# EAGLE board MaTouch ESP32-P4 TFT with 4G LTE  Touch 10.1“ MIPI V1.0 (EAGLE 6.1), part 1 of 3
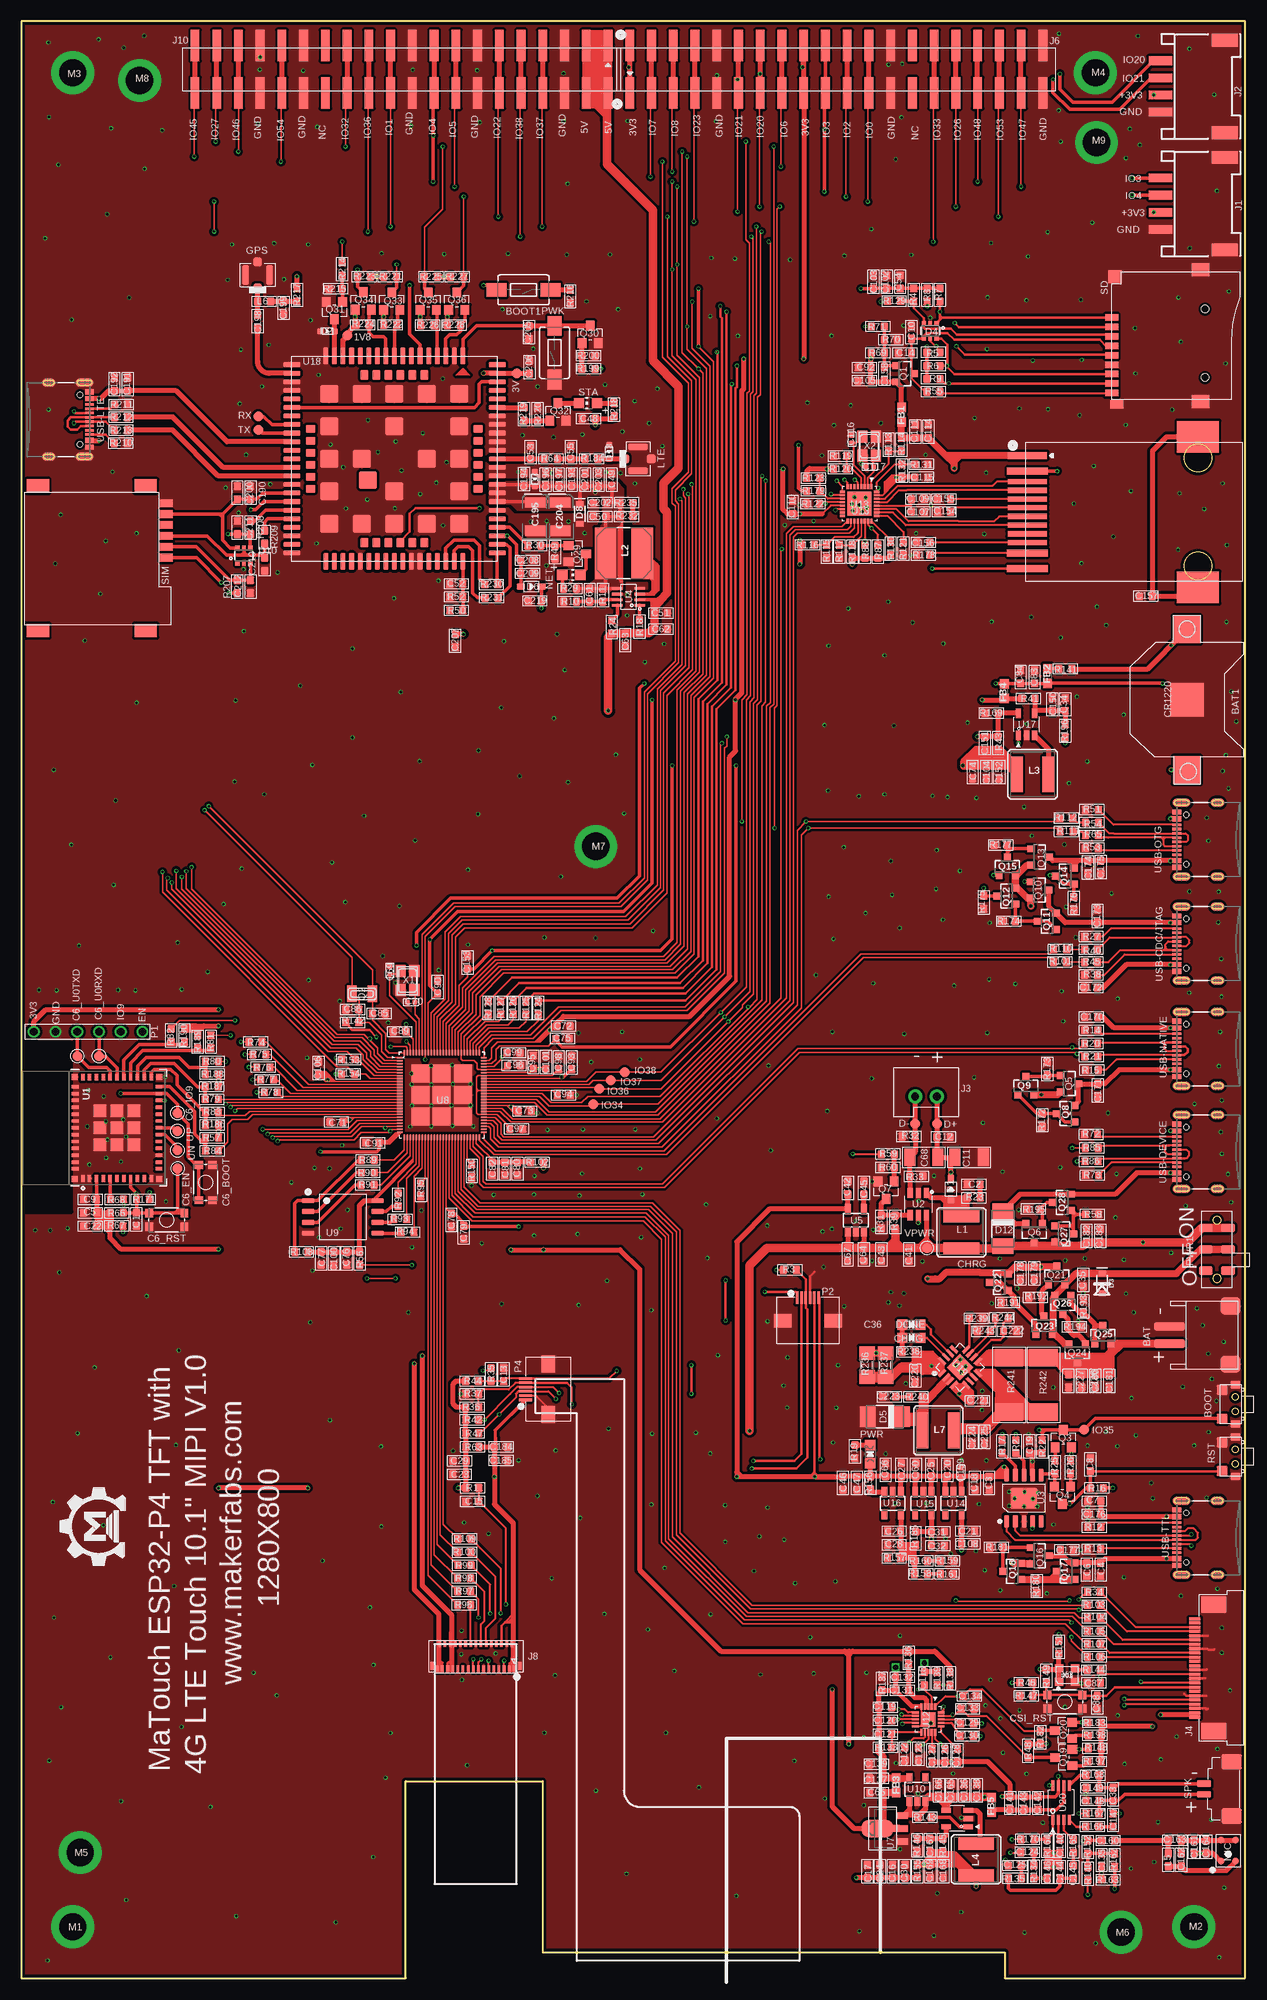
[diagram p7: board, top side]
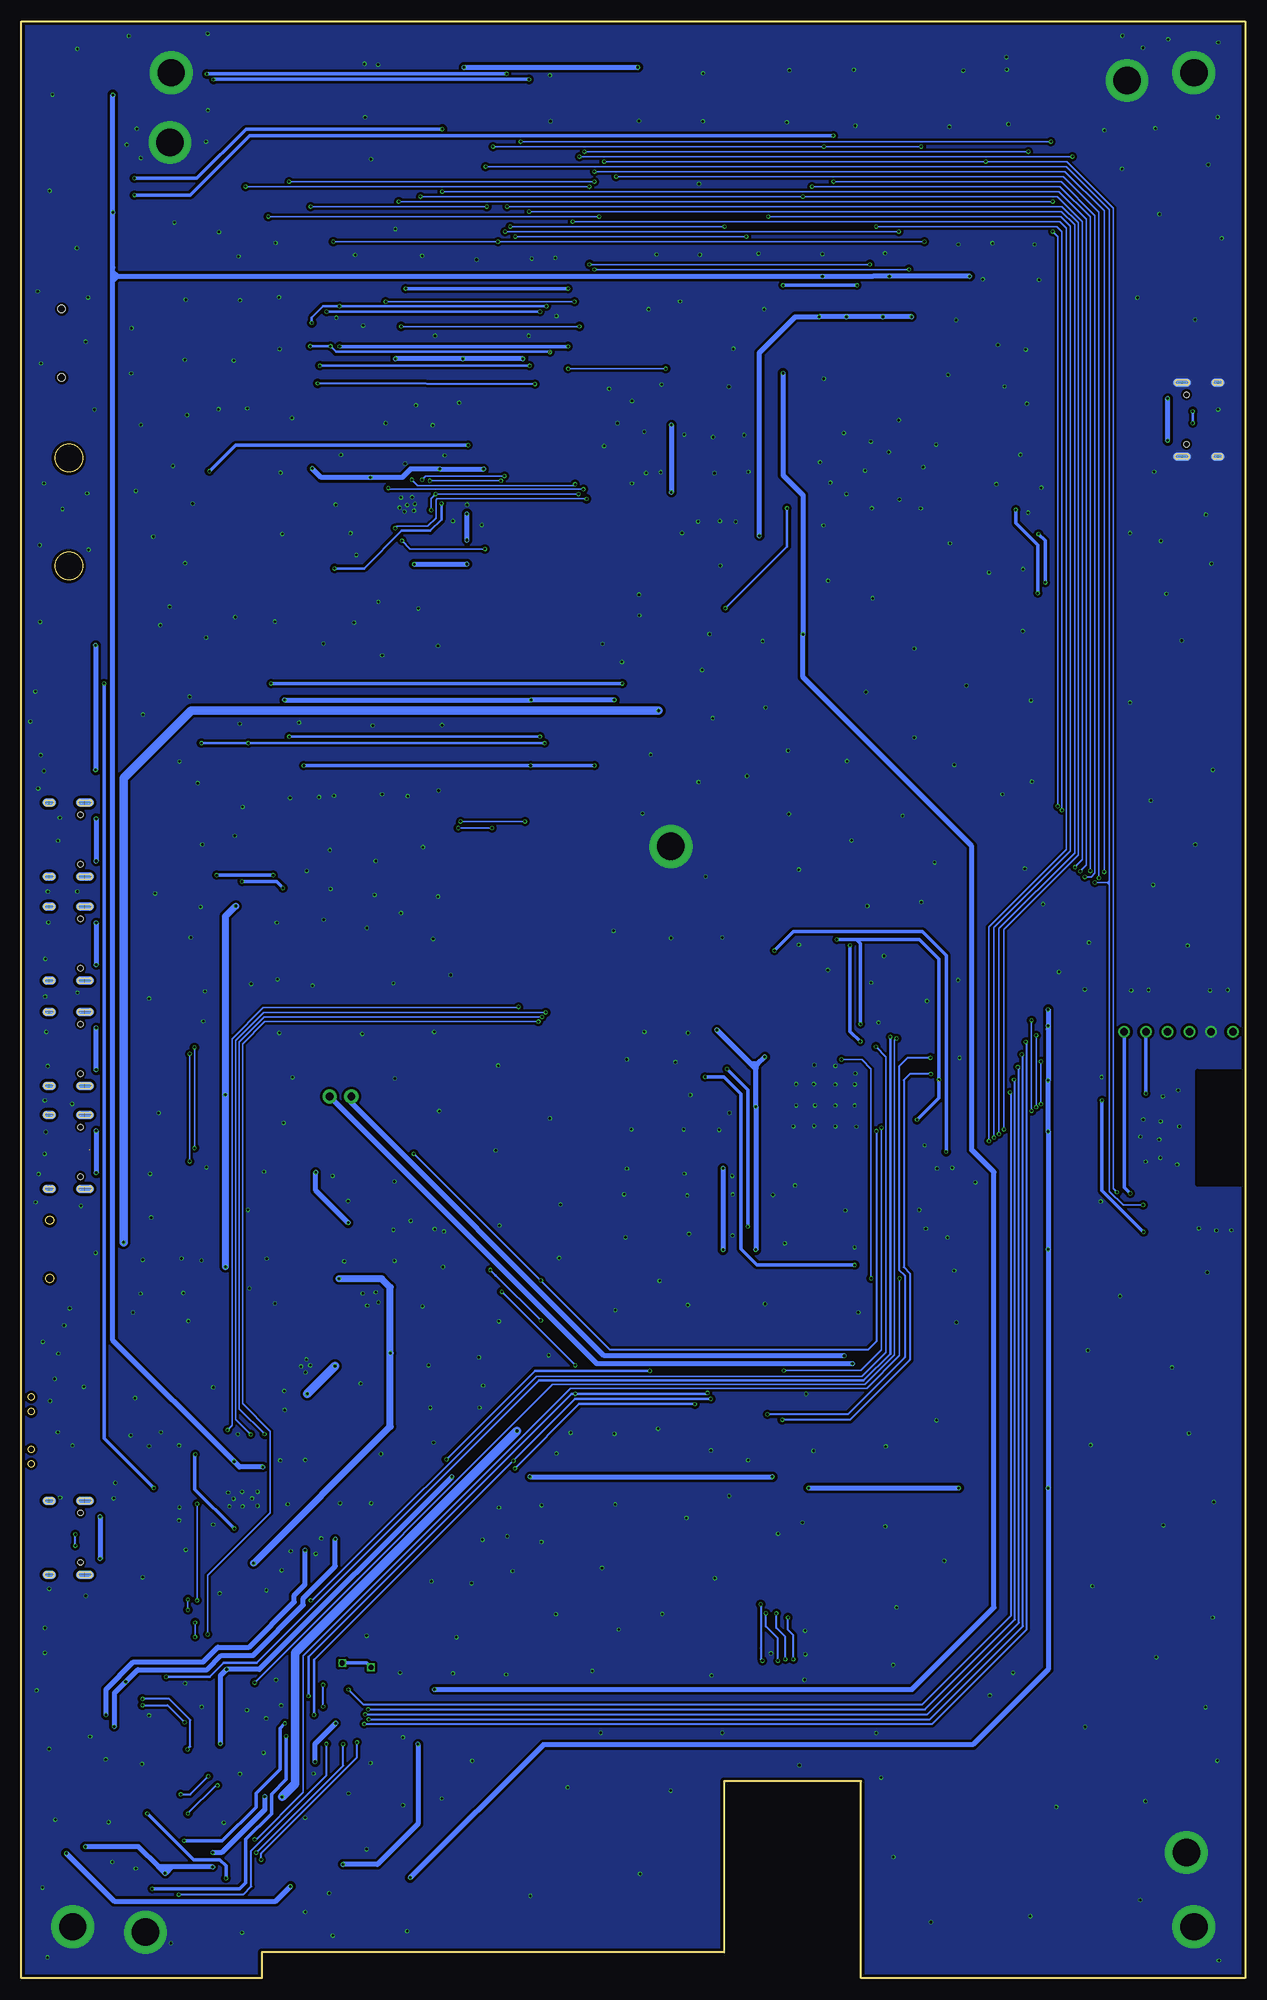
[diagram p8: board, bottom side, seen from below]

Size 143 x 228.6 mm. Coordinates in mm from the lower left corner, seen from the top.
Outline: 60.9,23 44.9,23 44.9,0 0,0 0,228.6 143,228.6 143,0 114.9,0 114.9,3 60.9,3 60.9,22.96
Copper layers (1*16): Top 0.035mm / dielectric 1.5mm / Bottom 0.035mm
Design rules: minimum track width 7mil, minimum drill 10mil, track to track 6mil, track to pad 6mil, pad to pad 6mil, via to via 6mil, smd to smd 0mil, copper to edge 6mil, drill to drill 6mil, minimum pad ring 3mil, minimum via ring 3mil, stop-mask expansion 2mil, vias tented up to drill 100mil, thermal gap 0mil
Net classes: 0 default: width 0.152 mm, drill 0.305 mm, clearance 0.152 mm; 1 vbat: drill 0.305 mm
tRestrict: area 0.1,89.6 to 5.8,109.2; area 70.6,163.4 to 71.1,169.7
bRestrict: area -6,89.6 to -0.3,109.2

## Footprints (pad centres in the part's own frame; a part is rotated, then mirrored left to right if it is on the bottom)
TP-D45MIL = smd 1.143 x 1.143: T 0,0
HW2-SMD-2.0-90D = smd 2 x 2.4: 3 3.4,-2.181; 4 -3.4,-2.181 | smd 1 x 3.6: + -1,4.953; - 1,4.953
CR1220-SMD = smd 3.2 x 3.2: +$1 -8.2,0; +$2 8.2,0 | smd 3.9 x 3.9: - 0,0
2*4*3.5MM = smd 1.15 x 1.3: 1 -1.675,0; 2 1.675,0 | smd 0.9 x 1.2: 3 2.3,1.55; 4 -2.3,1.55
TACTILE_SWITCH_SMD_6.0X3.5MM = smd 2.3 x 1.6: 1 -3.15,0; 2 3.15,0
0603 = smd 0.889 x 0.889: 1 -0.762,0; 2 0.762,0
DISCRETE_C0603 = smd 0.889 x 0.889: 1 -0.762,0; 2 0.762,0
TACTILE_SWITCH_SMD_4.6X2.8MM = smd 0.9 x 1: 1 -2.05,-0.8; 2 2.05,-0.8; 3 2.05,0.8; 4 -2.05,0.8
TP_4545 = smd 1.143 x 1.143: T 0,0
DISCRETE_C1206 = smd 1.27 x 2.032: 1 -1.651,0; 2 1.651,0
DISCRETE_C0402 = smd 0.635 x 0.635: 1 -0.445,0; 2 0.445,0
C0402 = smd 0.635 x 0.635: 1 0,0.484; 2 0,-0.484
C0603 = smd 0.889 x 0.889: 1 0,0.762; 2 0,-0.762
EIA3528 = smd 1.2 x 2.5: A 1.65,0; C -1.65,0
CHIPLED_0805_NOOUTLINE = smd 1.2 x 1.2: A 0,-1.05; C 0,1.05
SOD323 = smd 1 x 0.8: + -1.2,0; - 1.2,0
DISCRETE_SOD523 = smd 0.762 x 0.7: + -0.8,0; - 0.8,0
SOD-323 = smd 0.63 x 0.83: A 1.15,0; C -1.15,0
SOT363 = smd 0.5 x 0.5: 1 -0.75,-0.9; 3 0.75,-0.9; 4 0.75,0.9; 6 -0.75,0.9 | smd 0.4 x 0.5: 2 0,-0.9; 5 0,0.9
DO-214AC = smd 1.8 x 2.4: A 2.025,0; C -2.025,0
0603' = smd 1.1 x 1: 1 -0.85,0; 2 0.85,0
4P-U-FL = smd 1.016 x 1.016: D -1.524,0; GND3 1.524,0 | smd 2.286 x 0.762: GND1 0,1.397; GND2 0,-1.397
HW4-SMD-2.0-90D = smd 1.01 x 2.74: 1 -3,-0.1; 2 -1,-0.1; 3 1,-0.1; 4 3,-0.1 | smd 1.5 x 3: SS1 -5.4,7.4; SS2 5.4,7.4
XH2.54-2P = drill 0.9 pad 1.651: 1 -1.27,0; 2 1.27,0
SMD26-50P-1760L450W = smd 0.3 x 1.3: 1 5.75,0; 2 5.25,0; 3 4.75,0; 4 4.25,0; 5 3.75,0; 6 3.25,0; 7 2.75,0; 8 2.25,0; 9 1.75,0; 10 1.25,0; 11 0.75,0; 12 0.25,0; 13 -0.25,0; 14 -0.75,0; 15 -1.25,0; 16 -1.75,0; 17 -2.25,0; 18 -2.75,0; 19 -3.25,0; 20 -3.75,0; 21 -4.25,0; 22 -4.75,0; 23 -5.25,0; 24 -5.75,0 | smd 2 x 3: 25 -7.4,-2.25; 26 7.4,-2.25
SMD2X20-254P-5080L750W920H = smd 1.02 x 3.65: 1 -24.13,-2.775; 2 -24.13,2.775; 3 -21.59,-2.775; 4 -21.59,2.775; 5 -19.05,-2.775; 6 -19.05,2.775; 7 -16.51,-2.775; 8 -16.51,2.775; 9 -13.97,-2.775; 10 -13.97,2.775; 11 -11.43,-2.775; 12 -11.43,2.775; 13 -8.89,-2.775; 14 -8.89,2.775; 15 -6.35,-2.775; 16 -6.35,2.775; 17 -3.81,-2.775; 18 -3.81,2.775; 19 -1.27,-2.775; 20 -1.27,2.775; 21 1.27,-2.775; 22 1.27,2.775; 23 3.81,-2.775; 24 3.81,2.775; 25 6.35,-2.775; 26 6.35,2.775; 27 8.89,-2.775; 28 8.89,2.775; 29 11.43,-2.775; 30 11.43,2.775; 31 13.97,-2.775; 32 13.97,2.775; 33 16.51,-2.775; 34 16.51,2.775; 35 19.05,-2.775; 36 19.05,2.775; 37 21.59,-2.775; 38 21.59,2.775; 39 24.13,-2.775; 40 24.13,2.775
HR961160C = smd 0.81 x 4.6: 1 -6.61,-9.961 | smd 0.81 x 4.77: 2 -4.77,-9.961; 11 4.77,-9.961; 12 6.61,-9.961 | smd 0.61 x 4.6: 3 -3.57,-9.961; 4 -2.55,-9.961; 5 -1.53,-9.961; 6 -0.51,-9.961; 7 0.51,-9.961; 8 1.53,-9.961; 9 2.55,-9.961; 10 3.57,-9.961 | smd 3.7 x 4.9: 13 8.799,9.961; 14 -8.799,9.961
SMD31-30P-1090L320W100H = smd 0.3 x 0.8: 1 4.5,-1.475; 3 3.9,-1.475; 5 3.3,-1.475; 7 2.7,-1.475; 9 2.1,-1.475; 11 1.5,-1.475; 13 0.9,-1.475; 15 0.3,-1.475; 17 -0.3,-1.475; 19 -0.9,-1.475; 21 -1.5,-1.475; 23 -2.1,-1.475; 25 -2.7,-1.475; 27 -3.3,-1.475; 29 -3.9,-1.475; 31 -4.5,-1.475 | smd 0.3 x 0.65: 2 4.2,1.4; 4 3.6,1.4; 6 3,1.4; 8 2.4,1.4; 10 1.8,1.4; 12 1.2,1.4; 14 0.6,1.4; 16 0,1.4; 18 -0.6,1.4; 20 -1.2,1.4; 22 -1.8,1.4; 24 -2.4,1.4; 26 -3,1.4; 28 -3.6,1.4; 30 -4.2,1.4 | smd 0.4 x 0.95: 32 5.15,-1.103; 33 -5.15,-1.103
CR54 = smd 4.2 x 1.4: P$1 0,1.85; P$2 0,-1.85
SRN6045 = smd 2.5 x 6: 1 -2.175,0; 2 2.125,0
L0603 = smd 0.889 x 0.889: 1 -0.762,0; 2 0.762,0
M2.5 = drill 3.2 pad 5: 1 0,0
MIC4-SMD-3.76X2.95MM = smd 0.8 x 0.8: 1 0.85,1.23; 2 0.85,-1.23; 3 -0.85,-1.23; 4 -0.85,1.23
CHIP-LED0805 = smd 1.2 x 1.2: A 0,-1.05; C 0,1.05
DEBUG*6 = drill 0.9: 1 0,0; 2 0,2.54; 3 0,5.08; 4 0,7.62; 5 0,10.16; 6 0,12.7
SMD8-50P-740L535W = smd 0.3 x 1.5: 1 -1.25,0; 2 -0.75,0; 3 -0.25,0; 4 0.25,0; 5 0.75,0; 6 1.25,0 | smd 2 x 1.6: 7 2.95,-2.68; 8 -2.95,-2.68
SMD-6-2.5MM = smd 1 x 1.6: 1 -2.5,1.3; 1@1 -2.5,-1.3; 2 0,1.3; 2@1 0,-1.3; 3 2.5,1.3; 3@1 2.5,-1.3
SOT23-3 = smd 0.8 x 0.9: 1 -0.95,-1; 2 0.95,-1; 3 0,1.1
XTAL3215 = smd 1.1 x 1.9: P$1 1.2,0; P$2 -1.2,0
SOT23 = smd 1.016 x 1.143: 1 -0.95,-1.016; 2 0.95,-1.016; 3 0,1.016
DISCRETE_R0603 = smd 0.889 x 0.889: 1 -0.762,0; 2 0.762,0
R0603 = smd 0.889 x 0.889: 1 -0.762,0; 2 0.762,0
1206 = smd 1.6 x 1.8: 1 -1.4,0; 2 1.4,0
DISCRETE_R2512 = smd 2.032 x 3.302: 1 -3.175,0; 2 3.175,0
9P-SMD-W/-RING = smd 1.524 x 0.762: 1 0,4.4; 2 0,3.3; 3 0,2.2; 4 0,1.1; 5 0,0; 6 0,-1.1; 7 0,-2.2; 8 0,-3.3; 9 0,-4.4 | smd 1.524 x 1.016: G1 0.6,-5.746 | smd 2.032 x 1.524: G2 10.373,-5.4; G3 10.373,10 | smd 1.524 x 1.524: G4 0.392,9.181 | hole 0.889: 10.9,-2.6; 10.9,5.4
MICROSIM = smd 1.5 x 0.9: 1 -0.8,2.5; 2 -0.8,5.04; 3 -0.8,7.58; 5 -0.8,1.23; 6 -0.8,3.77; 7 -0.8,6.31 | smd 2.61 x 1.56: P$1 1.6,-0.8; P$2 14.2,-0.8; P$3 14.2,16.1; P$4 1.6,16.1
1X2P-SMT1.25MM = smd 0.8 x 1.6: 1 -0.625,0; 2 0.625,0 | smd 1.8 x 2.4: 3 3.175,-3.2; 4 -3.175,-3.2
ESP32-C6-MINI-1 = smd 0.8 x 0.4: 1 -5.9,4; 2 -5.9,3.2; 3 -5.9,2.4; 4 -5.9,1.6; 5 -5.9,0.8; 6 -5.9,0; 7 -5.9,-0.8; 8 -5.9,-1.6; 9 -5.9,-2.4; 10 -5.9,-3.2; 11 -5.9,-4; 25 5.9,-4; 26 5.9,-3.2; 27 5.9,-2.4; 28 5.9,-1.6; 29 5.9,-0.8; 30 5.9,0; 31 5.9,0.8; 32 5.9,1.6; 33 5.9,2.4; 34 5.9,3.2; 35 5.9,4 | smd 0.4 x 0.8: 12 -4.8,-4.9; 13 -4,-4.9; 14 -3.2,-4.9; 15 -2.4,-4.9; 16 -1.6,-4.9; 17 -0.8,-4.9; 18 0,-4.9; 19 0.8,-4.9; 20 1.6,-4.9; 21 2.4,-4.9; 22 3.2,-4.9; 23 4,-4.9; 24 4.8,-4.9; 36 4.8,4.9; 37 4,4.9; 38 3.2,4.9; 39 2.4,4.9; 40 1.6,4.9; 41 0.8,4.9; 42 0,4.9; 43 -0.8,4.9; 44 -1.6,4.9; 45 -2.4,4.9; 46 -3.2,4.9; 47 -4,4.9; 48 -4.8,4.9 | smd 1.45 x 1.45: 49.1 -1.975,1.975; 49.2 -1.975,0; 49.3 -1.975,-1.975; 49.4 0,-1.975; 49.5 1.975,-1.975; 49.6 1.975,0; 49.7 1.975,1.975; 49.8 0,1.975; 49.9 0,0 | smd 0.7 x 0.7: 50 5.95,4.95; 51 5.95,-4.95; 52 -5.95,-4.95; 53 -5.95,4.95
SOT23-6 = smd 1.2 x 0.6: 1 -1.3,0.95; 2 -1.3,0; 3 -1.3,-0.95; 4 1.3,-0.95; 5 1.3,0; 6 1.3,0.95
ESOP-10-EP-150MIL = smd 1.5 x 0.6: 1 -2.7,2; 2 -2.7,1; 3 -2.7,0; 4 -2.7,-1; 5 -2.7,-2; 6 2.7,-2; 7 2.7,-1; 8 2.7,0; 9 2.7,1; 10 2.7,2 | smd 2.4 x 3.2: EP 0,0
TSOT23-8 = smd 1.2 x 0.3: 1 -1.3,0.975; 2 -1.3,0.325; 3 -1.3,-0.325; 4 -1.3,-0.975; 5 1.3,-0.975; 6 1.3,-0.325; 7 1.3,0.325; 8 1.3,0.975
SOT23-5 = smd 0.69 x 1.2: 1 -0.95,-1.3; 2 0,-1.3; 3 0.95,-1.3; 4 0.95,1.3; 5 -0.95,1.3
SOT89 = smd 0.8 x 1.4: 1 -1.524,-1.905; 3 1.524,-1.905 | smd 0.8 x 1.9: 2 0,-1.651 | smd 2.032 x 3.65: 4 0,0.94
QFN105-35P-500L500W = smd 0.65 x 0.18: 1 -4.925,4.375; 2 -4.925,4.025; 3 -4.925,3.675; 4 -4.925,3.325; 5 -4.925,2.975; 6 -4.925,2.625; 7 -4.925,2.275; 8 -4.925,1.925; 9 -4.925,1.575; 10 -4.925,1.225; 11 -4.925,0.875; 12 -4.925,0.525; 13 -4.925,0.175; 14 -4.925,-0.175; 15 -4.925,-0.525; 16 -4.925,-0.875; 17 -4.925,-1.225; 18 -4.925,-1.575; 19 -4.925,-1.925; 20 -4.925,-2.275; 21 -4.925,-2.625; 22 -4.925,-2.975; 23 -4.925,-3.325; 24 -4.925,-3.675; 25 -4.925,-4.025; 26 -4.925,-4.375; 53 4.925,-4.375; 54 4.925,-4.025; 55 4.925,-3.675; 56 4.925,-3.325; 57 4.925,-2.975; 58 4.925,-2.625; 59 4.925,-2.275; 60 4.925,-1.925; 61 4.925,-1.575; 62 4.925,-1.225; 63 4.925,-0.875; 64 4.925,-0.525; 65 4.925,-0.175; 66 4.925,0.175; 67 4.925,0.525; 68 4.925,0.875; 69 4.925,1.225; 70 4.925,1.575; 71 4.925,1.925; 72 4.925,2.275; 73 4.925,2.625; 74 4.925,2.975; 75 4.925,3.325; 76 4.925,3.675; 77 4.925,4.025; 78 4.925,4.375 | smd 0.18 x 0.65: 27 -4.375,-4.925; 28 -4.025,-4.925; 29 -3.675,-4.925; 30 -3.325,-4.925; 31 -2.975,-4.925; 32 -2.625,-4.925; 33 -2.275,-4.925; 34 -1.925,-4.925; 35 -1.575,-4.925; 36 -1.225,-4.925; 37 -0.875,-4.925; 38 -0.525,-4.925; 39 -0.175,-4.925; 40 0.175,-4.925; 41 0.525,-4.925; 42 0.875,-4.925; 43 1.225,-4.925; 44 1.575,-4.925; 45 1.925,-4.925; 46 2.275,-4.925; 47 2.625,-4.925; 48 2.975,-4.925; 49 3.325,-4.925; 50 3.675,-4.925; 51 4.025,-4.925; 52 4.375,-4.925; 79 4.375,4.925; 80 4.025,4.925; 81 3.675,4.925; 82 3.325,4.925; 83 2.975,4.925; 84 2.625,4.925; 85 2.275,4.925; 86 1.925,4.925; 87 1.575,4.925; 88 1.225,4.925; 89 0.875,4.925; 90 0.525,4.925; 91 0.175,4.925; 92 -0.175,4.925; 93 -0.525,4.925; 94 -0.875,4.925; 95 -1.225,4.925; 96 -1.575,4.925; 97 -1.925,4.925; 98 -2.275,4.925; 99 -2.625,4.925; 100 -2.975,4.925; 101 -3.325,4.925; 102 -3.675,4.925; 103 -4.025,4.925; 104 -4.375,4.925 | smd 2.1 x 2.1: 105 0,0; 106 -2.5,0; 107 2.5,0; 108 2.5,2.5; 109 0,2.5; 110 -2.5,2.5; 111 -2.5,-2.5; 112 0,-2.5; 113 2.5,-2.5
SOIC-8-208MIL = smd 1.5 x 0.635: 1 -4.05,1.905; 2 -4.05,0.635; 3 -4.05,-0.635; 4 -4.05,-1.905; 5 4.05,-1.905; 6 4.05,-0.635; 7 4.05,0.635; 8 4.05,1.905
SOT23-5-95P-300L300W = smd 1.1 x 0.6: 1 -1.3,0.95; 2 -1.3,0; 3 -1.3,-0.95; 4 1.3,-0.95; 5 1.3,0.95
QFN20-40P-300L300W55H = smd 0.8 x 0.25: 1 -1.5,0.8; 2 -1.5,0.4; 3 -1.5,0; 4 -1.5,-0.4; 5 -1.5,-0.8; 11 1.5,-0.8; 12 1.5,-0.4; 13 1.5,0; 14 1.5,0.4; 15 1.5,0.8 | smd 0.25 x 0.8: 6 -0.8,-1.5; 7 -0.4,-1.5; 8 0,-1.5; 9 0.4,-1.5; 10 0.8,-1.5; 16 0.8,1.5; 17 0.4,1.5; 18 0,1.5; 19 -0.4,1.5; 20 -0.8,1.5 | smd 1.7 x 1.7: 21 0,0
QFN32-40P-400W400L = smd 0.6 x 0.25: 1 -2,1.4; 2 -2,1; 3 -2,0.6; 4 -2,0.2; 5 -2,-0.2; 6 -2,-0.6; 7 -2,-1; 8 -2,-1.4; 17 2,-1.4; 18 2,-1; 19 2,-0.6; 20 2,-0.2; 21 2,0.2; 22 2,0.6; 23 2,1; 24 2,1.4 | smd 0.25 x 0.6: 9 -1.4,-2; 10 -1,-2; 11 -0.6,-2; 12 -0.2,-2; 13 0.2,-2; 14 0.6,-2; 15 1,-2; 16 1.4,-2; 25 1.4,2; 26 1,2; 27 0.6,2; 28 0.2,2; 29 -0.2,2; 30 -0.6,2; 31 -1,2; 32 -1.4,2 | smd 2.8 x 2.8: 33 0,0
A7670G = smd 2 x 0.6: 1 -12,8; 2 -12,7; 3 -12,6; 4 -12,5; 5 -12,4; 6 -12,3; 7 -12,2; 8 -12,1; 9 -12,0; 10 -12,-1; 11 -12,-2; 12 -12,-3; 13 -12,-4; 14 -12,-5; 15 -12,-6; 16 -12,-7; 17 -12,-8; 35 12,-8; 36 12,-7; 37 12,-6; 38 12,-5; 39 12,-4; 40 12,-3; 41 12,-2; 42 12,-1; 43 12,0; 44 12,1; 45 12,2; 46 12,3; 47 12,4; 48 12,5; 49 12,6; 50 12,7; 51 12,8 | smd 0.6 x 2: 18 -8,-12; 19 -7,-12; 20 -6,-12; 21 -5,-12; 22 -4,-12; 23 -3,-12; 24 -2,-12; 25 -1,-12; 26 0,-12; 27 1,-12; 28 2,-12; 29 3,-12; 30 4,-12; 31 5,-12; 32 6,-12; 33 7,-12; 34 8,-12; 52 8,12; 53 7,12; 54 6,12; 55 5,12; 56 4,12; 57 3,12; 58 2,12; 59 1,12; 60 0,12; 61 -1,12; 62 -2,12; 63 -3,12; 64 -4,12; 65 -5,12; 66 -6,12; 67 -7,12; 68 -8,12; 89 -11,-12; 90 -10,-12; 91 -9,-12; 92 9,-12; 93 10,-12; 94 11,-12; 95 11,12; 96 10,12; 97 9,12; 98 -9,12; 99 -10,12; 100 -11,12 | smd 2.1 x 2.1: 69 -7.6,7.6; 70 -7.6,3.8; 71 -7.6,0; 72 -7.6,-3.8; 73 -7.6,-7.6; 74 -3.8,-7.6; 75 0,-7.6; 76 3.8,-7.6; 77 7.6,-7.6; 78 7.6,-3.8; 79 7.6,0; 80 7.6,3.8; 81 7.6,7.6; 82 3.8,7.6; 83 0,7.6; 84 -3.8,7.6; 85 -3.8,0; 86 0,-3.8; 87 3.8,0; 88 0,3.8 | smd 1.1 x 0.9: 101 -9.8,3.5; 102 -9.8,2.1; 103 -9.8,0.7; 104 -9.8,-0.7; 105 -9.8,-2.1; 106 -9.8,-3.5; 113 9.8,-3.5; 114 9.8,-2.1; 115 9.8,-0.7; 116 9.8,0.7; 117 9.8,2.1; 118 9.8,3.5 | smd 0.9 x 1.1: 107 -3.5,-9.8; 108 -2.1,-9.8; 109 -0.7,-9.8; 110 0.7,-9.8; 111 2.1,-9.8; 112 3.5,-9.8; 119 3.5,9.8; 120 2.1,9.8; 121 0.7,9.8; 122 -0.7,9.8; 123 -2.1,9.8; 124 -3.5,9.8 | smd 2.05 x 2.05: 125 2.5,-3.1
QFN17-65P-400L400W80H = smd 0.364 x 1.087: 1 -0.975,-1.968; 2 -0.325,-1.968; 3 0.325,-1.968; 4 0.975,-1.968; 9 0.975,1.968; 10 0.325,1.968; 11 -0.325,1.968; 12 -0.975,1.968 | smd 1.087 x 0.364: 5 1.969,-0.975; 6 1.969,-0.325; 7 1.969,0.325; 8 1.969,0.975; 13 -1.968,0.975; 14 -1.968,0.325; 15 -1.968,-0.325; 16 -1.968,-0.975 | smd 2.2 x 2.2: 17 0,0
MSOP8-65P-490L300W110H = smd 1.2 x 0.38: 1 -2,0.975; 2 -2,0.325; 3 -2,-0.325; 4 -2,-0.975; 5 2,-0.975; 6 2,-0.325; 7 2,0.325; 8 2,0.975
USB-C-16P-5 = smd 0.3 x 1: A5 -1.25,-0.34; A6 -0.25,-0.34; A7 0.25,-0.34; A8 1.25,-0.34; B5 1.75,-0.34; B6 0.75,-0.34; B7 -0.75,-0.34; B8 -1.75,-0.34 | smd 0.6 x 1: GND -3.225,-0.34; GND2 3.225,-0.34; VBUS1 -2.45,-0.34; VBUS2 2.45,-0.34 | smd 1 x 2.1: SHLD1 -4.32,-0.915; SHLD2 4.32,-0.915 | smd 1 x 2.1 bottom: SHLD3 -4.32,-0.915; SHLD4 4.32,-0.915 | smd 1 x 1.6: SHLD5 -4.32,-5.095; SHLD8 4.32,-5.095 | smd 1 x 1.6 bottom: SHLD6 -4.32,-5.095; SHLD7 4.32,-5.095 | hole 0.65: -2.89,-1.445; 2.89,-1.445
NX3225 = smd 1.4 x 1.2: 1 -1.1,-0.8; 2 1.1,-0.8; 3 1.1,0.8; 4 -1.1,0.8
OSC4-SMD-2.5X2.0X0.8MM = smd 1 x 0.95: 1 -0.925,-0.775; 2 0.925,-0.775; 3 0.925,0.775; 4 -0.925,0.775

## Placement (x,y rotation side)
1V8  [TP-D45MIL]  38.1,191.9 270 top
3V  [TP-D45MIL]  57.88,187.48 180 top
BAT  JST-2P  [HW2-SMD-2.0-90D]  139.1,75.13 90 top
BAT1  [CR1220-SMD]  136.19,149.35 270 top
BOOT  TS24CA  [2*4*3.5MM]  140.3,67.04 270 top
BOOT1  MOMENTARY-SWITCH-SPST-SMD-6.0X3.5MM  [TACTILE_SWITCH_SMD_6.0X3.5MM]  58.67,197.23 180 top
C1  1uF/16V  [0603]  13.43,88.65 270 top
C2  10pF/50V  [DISCRETE_C0603]  111.27,92.74 0 top
C3  10uF  [DISCRETE_C0603]  113.08,57.84 90 top
C4  10uF  [DISCRETE_C0603]  126.11,47.73 90 top
C5  10uF  [0603]  8.02,89.41 180 top
C6  10uF  [DISCRETE_C0603]  124.48,47.73 90 top
C6_BOOT  MOMENTARY-SWITCH-SPST-SMD-4.6X2.8MM  [TACTILE_SWITCH_SMD_4.6X2.8MM]  21.54,92.94 90 top
C6_EN  [TP_4545]  18.26,94.59 90 top
C6_IO9  [TP_4545]  18.23,101.07 90 top
C6_RST  MOMENTARY-SWITCH-SPST-SMD-4.6X2.8MM  [TACTILE_SWITCH_SMD_4.6X2.8MM]  16.99,88.57 0 top
C6_U0RXD  [TP_4545]  9.06,107.72 90 top
C6_U0TXD  [TP_4545]  6.52,107.72 90 top
C7  0.1uF  [DISCRETE_C0603]  125.37,55.73 0 top
C8  0.1uF  [DISCRETE_C0603]  124.89,59.99 270 top
C9  0.1uF  [0603]  8.02,90.98 180 top
C10  10uF  [DISCRETE_C0603]  104.01,192.3 270 top
C11  4.7uF/35V  [DISCRETE_C1206]  110.74,95.89 180 top
C12  0.1uF/50V  [DISCRETE_C0603]  107.74,98.27 180 top
C13  NC  [DISCRETE_C0603]  56.36,70.51 270 top
C14  0.1uF  [DISCRETE_C0603]  103.25,189.87 0 top
C15  100nF  [DISCRETE_C0603]  52.7,55.68 0 top
C16  10uF  [DISCRETE_C0603]  101.8,12.47 270 top
C17  0.1uF  [DISCRETE_C0603]  98.85,12.47 270 top
C18  0.1uF  [DISCRETE_C0603]  111.43,57.84 90 top
C19  0.1uF  [DISCRETE_C0603]  117.78,62.1 270 top
C20  4.7uF/16V  [0603]  108.2,59.39 90 top
C21  10uF  [0603]  110.61,52.22 0 top
C22  10uF  [0603]  8.03,87.85 180 top
C23  10uF  [DISCRETE_C0603]  51.17,58.86 0 top
C24  0.1uF  [DISCRETE_C0603]  100.32,12.47 270 top
C25  4.7uF/16V  [0603]  106.32,59.39 90 top
C26  0.1uF  [DISCRETE_C0603]  101.98,52.22 0 top
C27  4.7uF/16V  [0603]  102.82,59.39 90 top
C28  10uF  [0603]  101.98,50.62 180 top
C29  10uF  [DISCRETE_C0603]  51.19,60.43 0 top
C30  0.1uF  [DISCRETE_C0603]  103.25,12.49 270 top
C31  10uF  [0603]  107.08,52.15 0 top
C32  0.1uF  [DISCRETE_C0603]  107.08,50.52 180 top
C33  330pF/50V  [0603]  127.55,21.46 90 top
C34  10uF  [0603]  121.97,148.82 90 top
C35  10uF  [0603]  124.08,81.56 90 top
C41  4.7uF/16V  [0603]  103.73,84.53 270 top
C42  10uF  [0603]  96.57,92.3 90 top
C43  10uF  [0603]  100.48,84.53 90 top
C45  NC  [0603]  98.45,92.3 90 top
C46  10uF  [DISCRETE_C0603]  95.98,57.84 90 top
C47  0.1uF  [DISCRETE_C0603]  97.63,57.84 90 top
C48  10uF  [0603]  66.29,182.19 0 top
C49  1uF  [0603]  68.98,175.08 270 top
C50  1uF  [0603]  67.59,170.76 0 top
C51  0.1uF  [0603]  74.72,159.49 180 top
C52  1nF  [0603]  50.82,162.89 180 top
C53  NC  [0603]  59.51,178.26 270 top
C54  10uF  [DISCRETE_C0603]  102.68,198.17 270 top
C55  NC  [0603]  64.21,178.26 270 top
C60  0.1uF  [DISCRETE_C0603]  104.52,59.39 270 top
C61  33pF  [0603]  66.42,161.57 90 top
C62  10uF  [0603]  74.72,157.61 180 top
C63  1uF  [0603]  70.56,156.34 90 top
C64  4.7uF/16V  [0603]  98.45,84.53 270 top
C65  10uF  [0603]  99.89,21.64 180 top
C66  0.1uF  [DISCRETE_C0603]  100.99,59.39 270 top
C67  0.1uF  [0603]  96.54,84.53 90 top
C68  NC  [DISCRETE_C1206]  105.46,95.89 0 top
C69  12pF  [DISCRETE_C0402]  43.05,117.73 90 top
C70  12pF  [DISCRETE_C0402]  45.54,114.02 0 top
C71  10uF  [0603]  36.8,100.03 180 top
C72  0.1uF  [0603]  63.34,111.23 0 top
C73  0.1uF  [0603]  58.82,101.27 0 top
C74  10uF  [0603]  111.15,140.89 270 top
C75  0.1uF  [0603]  63.22,109.75 0 top
C76  10uF  [0603]  38.02,84.07 270 top
C77  0.1uF  [0603]  35.02,84.07 270 top
C78  10uF  [0603]  50.24,88.57 270 top
C79  0.1uF  [0603]  51.68,87.12 270 top
C80  10uF  [0603]  57.98,94.56 270 top
C81  0.1uF  [0603]  56.49,94.56 270 top
C82  10nF  [0603]  54.99,94.56 270 top
C83  10uF  [0603]  118.39,152.02 90 top
C84  0.1uF  [0603]  116.76,152.02 90 top
C85  20pF  [DISCRETE_C0603]  41.78,112.7 0 top
C86  20pF  [DISCRETE_C0603]  38.68,113.16 180 top
C87  15pF  [DISCRETE_C0603]  125.32,34.49 0 top
C88  15pF  [DISCRETE_C0603]  125.7,32.21 90 top
C89  10uF  [0603]  44.19,110.57 180 top
C90  0.1uF  [0603]  48.64,115.8 90 top
C91  0.1uF  [0603]  41.02,97.59 180 top
C92  0.1uF  [0603]  98.52,188.16 180 top
C93  1uF/16V  [0603]  64.31,106.98 90 top
C94  1uF/16V  [0603]  63.37,103.15 0 top
C95  1uF/16V  [0603]  59.81,107.01 90 top
C96  1uF/16V  [0603]  57.55,106.6 0 top
C97  10uF  [0603]  57.83,99.19 0 top
C98  0.1uF  [0603]  62.78,106.98 90 top
C99  0.1uF  [0603]  57.5,108.1 0 top
C100  0.1uF  [0603]  36.52,84.07 270 top
C101  1uF  [0603]  61.29,107.01 90 top
C102  10uF  [0603]  101.11,198.17 90 top
C103  0.1uF  [0603]  99.54,198.17 90 top
C104  0.1uF  [0603]  112.75,140.89 270 top
C105  0.1uF  [0603]  98.52,186.61 180 top
C106  0.1uF  [0603]  34.72,106.32 90 top
C107  10uF  [0603]  104.75,171.3 0 top
C108  0.1uF  [DISCRETE_C0603]  110.61,50.75 180 top
C109  0.1uF  [0603]  104.75,172.8 0 top
C110  10uF  [0603]  90.12,171.83 90 top
C111  0.1uF  [0603]  104.47,180.7 90 top
C114  10uF  [0603]  105.99,180.7 90 top
C115  0.1uF  [0603]  105.15,175.34 0 top
C116  12pF  [DISCRETE_C0402]  97.05,179.81 90 top
C117  12pF  [DISCRETE_C0402]  99.13,176.56 0 top
C118  22pF  [0603]  105.51,35 90 top
C119  22pF  [0603]  100.94,31.62 180 top
C120  22pF  [0603]  100.94,30.1 180 top
C121  1uF/16V  [0603]  100.94,28.5 180 top
C122  22pF  [0603]  103.22,26.21 270 top
C123  22pF  [0603]  104.82,26.19 270 top
C124  1uF/16V  [0603]  117.55,14.71 0 top
C125  1uF/16V  [0603]  116.07,13.16 0 top
C126  1uF/16V  [0603]  107.92,26.04 90 top
C127  1uF/16V  [0603]  106.42,26.04 90 top
C128  1uF/16V  [0603]  109.39,26.04 270 top
C129  1uF/16V  [0603]  110.51,29.74 0 top
C130  1uF/16V  [0603]  110.46,28.27 0 top
C131  0.1uF  [0603]  102.92,33.63 180 top
C132  0.1uF  [0603]  102.92,35.15 180 top
C133  22pF  [0603]  110.56,31.47 0 top
C134  22pF  [0603]  110.79,32.94 0 top
C135  1uF/16V  [0603]  126.21,13.79 270 top
C136  4.7uF/16V  [0603]  110.16,21.92 90 top
C137  10uF  [0603]  99.89,23.34 180 top
C138  0.1uF  [0603]  111.65,21.92 270 top
C139  0.1uF  [0603]  99.89,24.97 0 top
C140  1uF/16V  [0603]  121.36,15.44 270 top
C141  1uF/16V  [0603]  115.54,20.45 90 top
C142  10uF  [0603]  118.79,20.45 90 top
C143  0.1uF  [0603]  117.19,20.45 90 top
C144  22pF  [0603]  121.36,12.4 90 top
C145  0.1uF  [0603]  122.91,12.4 90 top
C146  22pF  [0603]  119.86,12.42 90 top
C147  0.1uF  [0603]  127.55,18.47 270 top
C148  330pF/50V  [0603]  125.17,20.75 180 top
C149  330pF/50V  [0603]  125.17,22.23 0 top
C150  0.1uF  [0603]  120.47,148.82 270 top
C151  22pF  [0603]  112.59,144.27 90 top
C152  10uF  [0603]  114.27,140.89 270 top
C153  0.1uF  [0603]  52.14,118.67 270 top
C154  0.1uF  [0603]  107.82,171.3 180 top
C155  0.1uF  [0603]  107.79,172.8 180 top
C156  1nF/50V  [0603]  105.38,167.74 180 top
C157  1nF/50V  [0603]  131.39,161.44 180 top
C158  0.1uF  [DISCRETE_C0603]  100.83,187.45 270 top
C159  100nF  [C0402]  109.77,59.11 0 top
C160  10uF  [C0603]  126.97,16.08 270 top
C161  10uF  [C0603]  137,15.34 0 top
C162  33pF  [C0603]  135.53,13.82 180 top
C163  33pF  [C0603]  134.77,16.1 90 top
C164  100nF  [C0603]  138.45,15.34 180 top
C165  10uF  [0603]  108.66,21.92 90 top
C166  0.1uF  [0603]  107.18,21.92 270 top
C167  22pF  [0603]  106.17,15.52 90 top
C168  10uF  [0603]  107.72,12.5 270 top
C169  0.1uF  [0603]  106.22,12.5 90 top
C170  10uF  [0603]  125.01,112.29 180 top
C171  0.1uF  [0603]  125.78,103.71 270 top
C172  10uF  [0603]  124.96,115.72 180 top
C173  0.1uF  [0603]  125.75,124.08 90 top
C174  10uF  [0603]  124.61,129.77 270 top
C175  0.1uF  [0603]  126.13,129.79 270 top
C176  10uF  [0603]  125.37,54.2 180 top
C177  0.1uF  [0603]  122.17,50.06 0 top
C178  10uF  [0603]  116.73,82.35 270 top
C179  0.1uF  [0603]  118.36,82.35 270 top
C180  10uF  [0603]  125.5,69.77 270 top
C181  0.1uF  [0603]  127.1,69.77 270 top
C182  10uF  [0603]  124.46,86.72 90 top
C183  0.1uF  [0603]  126.06,86.72 90 top
C184  4.7uF/16V  [0603]  56.03,62.05 0 top
C185  0.1uF  [DISCRETE_C0603]  56.03,60.48 180 top
C190  33pF  [0603]  26.77,173.53 270 top
C191  10uF  [0603]  12.42,186.21 90 top
C192  0.1uF  [0603]  10.87,186.21 90 top
C193  10uF  [0603]  64.31,175.08 270 top
C194  1uF  [0603]  58.72,175.11 270 top
C195  100uF  [EIA3528]  60.09,170.74 90 top
C196  10uF  [0603]  61.26,175.08 270 top
C197  1uF  [0603]  62.78,175.08 270 top
C198  100pF  [0603]  27.61,193.57 270 top
C199  33pF  [0603]  30.65,195.12 270 top
C200  0.1uF  [0603]  25.24,173.53 270 top
C201  10pF  [0603]  65.88,175.08 270 top
C202  33pF  [0603]  67.61,172.36 0 top
C203  0.1uF  [0603]  67.46,175.08 270 top
C204  100uF  [EIA3528]  62.91,170.74 90 top
C205  NC  [0603]  59.3,192.28 90 top
C206  1uF  [0603]  59.38,188.21 270 top
C207  0.1uF  [0603]  50.69,156.24 90 top
C208  1uF  [0603]  59.13,165.63 180 top
C209  0.1uF  [0603]  59.13,164.11 180 top
C210  22pF_NC  [0603]  28.42,165.18 90 top
C211  22pF_NC  [0603]  25.24,169.47 270 top
C212  22pF_NC  [0603]  26.77,162.56 90 top
C219  33pF  [0603]  59.99,160.91 0 top
C220  10uF  [0603]  104.44,70.38 270 top
C221  0.1uF  [0603]  111.68,67.44 0 top
C222  0.1uF  [0603]  115.52,75.56 0 top
C223  0.1uF  [0603]  101.42,67.92 180 top
C224  0.1uF  [0603]  111.1,63.22 270 top
C225  10uF  [0603]  112.54,63.22 270 top
C226  0.1uF  [0603]  123.9,69.77 270 top
C227  10uF  [0603]  122.35,69.77 270 top
CHRG  RED  [CHIPLED_0805_NOOUTLINE]  103.98,74.8 270 top
CSI_RST  MOMENTARY-SWITCH-SPST-SMD-4.6X2.8MM  [TACTILE_SWITCH_SMD_4.6X2.8MM]  121.92,32.28 0 top
D1  1N4148WS  [SOD323]  108.61,92.15 90 top
D2  0603ESDA-05N  [DISCRETE_SOD523]  35.78,192.41 0 top
D3  5.1V  [SOD-323]  126.28,81.18 270 top
D4  SMF05C  [SOT363]  106.2,192.45 180 top
D5  SS54  [DO-214AC]  100.91,65.61 180 top
D6  B5819WS  [SOD323]  59.56,162.56 0 top
D7  0603ESDA-05N  [DISCRETE_SOD523]  59.99,175.13 270 top
D8  5.1V  [SOD-323]  65.25,171.07 270 top
D10  SMF05C  [SOT363]  26.01,166.19 0 top
D12  SS54  [DO-214AC]  114.68,87.55 270 top
D13  0603ESDA-05N  [DISCRETE_SOD523]  68.68,178.31 270 top
D+  [TP-D45MIL]  106.98,99.8 180 top
D-  [TP-D45MIL]  104.44,99.8 180 top
DONE  GREEN  [CHIPLED_0805_NOOUTLINE]  103.98,76.33 270 top
FB1  [0603']  102.84,182.68 90 top
FB2  [0603']  119.88,152.12 270 top
FB3  [0603']  102.23,22.5 90 top
FB4  [0603']  114.85,150.34 90 top
FB5  [0603']  113.36,20.24 90 top
GPS  [4P-U-FL]  27.61,198.98 90 top
IO34  [TP-D45MIL]  66.8,102.11 270 top
IO35  [TP-D45MIL]  124.15,64.06 90 top
IO36  [TP-D45MIL]  67.51,103.89 270 top
IO37  [TP-D45MIL]  68.88,104.88 270 top
IO38  [TP-D45MIL]  70.48,105.84 270 top
J1  [HW4-SMD-2.0-90D]  133.2,207.3 270 top
J2  [HW4-SMD-2.0-90D]  133.2,221.01 270 top
J3  XH2.54-2P  [XH2.54-2P]  105.71,103 180 top
J4  [SMD26-50P-1760L450W]  137.1,36.25 90 top
J6  [SMD2X20-254P-5080L750W920H]  95.22,223 0 top
J7  [HR961160C]  127.5,171.27 270 top
J8  CON31-30P-A  [SMD31-30P-1090L320W100H]  53.1,37.6 0 top
J10  [SMD2X20-254P-5080L750W920H]  44.42,223 180 top
L1  10µH/±30%  [CR54]  109.83,87.12 180 top
L2  4.7µH/±20%/3A  [SRN6045]  70.38,166.47 180 top
L3  2.2µH/±30%/3.4A  [CR54]  118.16,140.64 270 top
L4  2.2µH/±30%/3.4A  [CR54]  111.55,13.87 0 top
L5  BLM18BD252SN1  [L0603]  134.01,13.82 90 top
L6  68nH  [L0603]  28.37,195.88 180 top
L7  10µH/±20%/3.2A  [CR54]  107.13,63.98 90 top
LTE  [4P-U-FL]  72.06,177.5 0 top
M1  M2.5  [M2.5]  6,6 0 top
M2  M2.5  [M2.5]  137,6 0 top
M3  M2.5  [M2.5]  6,222.6 0 top
M4  M2.5  [M2.5]  125.5,222.6 0 top
M5  M2.5  [M2.5]  6.88,14.67 0 top
M6  M2.5  [M2.5]  128.5,5.37 0 top
M7  M2.5  [M2.5]  67.11,132.21 0 top
M8  M2.5  [M2.5]  13.81,221.7 0 top
M9  M2.5  [M2.5]  125.64,214.46 0 top
MIC  SAO-3729-M-42-008  [MIC4-SMD-3.76X2.95MM]  141.02,14.88 180 top
NET  NET  [CHIP-LED0805]  64.26,163.93 270 top
P1  DEBUG6  [DEBUG*6]  1.44,110.57 270 top
P2  AFC01-S06FCC-00  [SMD8-50P-740L535W]  91.9,79.5 0 top
P4  AFC01-S06FCC-00  [SMD8-50P-740L535W]  58.9,68.8 90 top
PWK  MOMENTARY-SWITCH-SPST-SMD-6.0X3.5MM  [TACTILE_SWITCH_SMD_6.0X3.5MM]  62.3,189.89 90 top
PWR  GREEN  [CHIPLED_0805_NOOUTLINE]  99.19,61.23 0 top
PWR1  JS102011JAQN  [SMD-6-2.5MM]  139.7,85.14 90 top
Q1  MOSFET-PCHANNEL  [SOT23-3]  103.22,187.43 270 top
Q2  32.768K  [XTAL3215]  39.82,114.99 0 top
Q3  S8050  [SOT23]  121.74,63.03 0 top
Q4  S8050  [SOT23]  121.64,56.41 180 top
Q5  MOSFET-PCHANNEL  [SOT23-3]  122.42,104.5 270 top
Q6  MOSFET-PCHANNEL  [SOT23-3]  118.33,87.1 180 top
Q7  S8050  [SOT23]  101.04,92.05 180 top
Q8  600mA/40V  [SOT23-3]  122.04,100.99 90 top
Q9  600mA/40V  [SOT23-3]  117.37,104.22 0 top
Q10  MOSFET-PCHANNEL  [SOT23-3]  118.92,127.13 270 top
Q11  600mA/40V  [SOT23-3]  119.86,123.47 90 top
Q12  600mA/40V  [SOT23-3]  115.13,126.42 90 top
Q13  MOSFET-PCHANNEL  [SOT23-3]  118.97,130.99 270 top
Q14  600mA/40V  [SOT23-3]  121.97,128.75 90 top
Q15  600mA/40V  [SOT23-3]  115.19,129.84 0 top
Q16  MOSFET-PCHANNEL  [SOT23-3]  118.94,49.35 270 top
Q17  600mA/40V  [SOT23-3]  122.07,47.55 90 top
Q18  600mA/40V  [SOT23-3]  115.79,47.52 90 top
Q19  BS138  [SOT23]  121.79,25.78 90 top
Q20  BS138  [SOT23]  121.76,28.93 90 top
Q21  MOSFET-PCHANNEL  [SOT23-3]  120.98,82.04 0 top
Q22  600mA/40V  [SOT23-3]  114.27,81.28 90 top
Q23  600mA/40V  [SOT23-3]  119.48,76.23 0 top
Q24  MOSFET-PCHANNEL  [SOT23-3]  123.36,73.08 180 top
Q25  600mA/40V  [SOT23-3]  126.36,75.11 0 top
Q26  600mA/40V  [SOT23-3]  121.69,78.69 180 top
Q27  600mA/40V  [SOT23-3]  121.81,86.94 270 top
Q28  600mA/40V  [SOT23-3]  121.61,90.63 90 top
Q29  BC847C  [SOT23]  64.94,166.4 270 top
Q30  2N7002  [SOT23]  66.47,192.02 0 top
Q31  2N7002  [SOT23]  36.57,194.82 180 top
Q32  BC847C  [SOT23]  62.68,182.98 0 top
Q33  2N7002  [SOT23]  43.28,195.91 0 top
Q34  2N7002  [SOT23]  39.95,195.94 0 top
Q35  2N7002  [SOT23]  47.54,195.91 0 top
Q36  2N7002  [SOT23]  50.87,195.91 0 top
R1  10K  [DISCRETE_R0603]  52.7,57.28 180 top
R2  0R  [R0603]  116.2,62.1 270 top
R3  NC  [R0603]  89.81,82.73 0 top
R4  51K  [DISCRETE_R0603]  104.26,196.65 90 top
R5  NC  [DISCRETE_R0603]  106.57,189.94 180 top
R6  51K  [DISCRETE_R0603]  106.57,188.37 180 top
R7  51K  [DISCRETE_R0603]  107.34,196.65 90 top
R8  51K  [DISCRETE_R0603]  105.84,196.65 90 top
R9  51K  [DISCRETE_R0603]  106.57,186.84 180 top
R10  33K  [R0603]  64.11,160.81 0 top
R11  200K  [R0603]  67.94,161.57 90 top
R12  5.1K  [DISCRETE_R0603]  125.37,52.68 0 top
R13  5.1K  [DISCRETE_R0603]  125.34,50.11 0 top
R14  5.1K  [DISCRETE_R0603]  125.01,110.74 0 top
R15  5.1K  [DISCRETE_R0603]  125.07,106.1 0 top
R16  10K  [R0603]  125.65,57.25 0 top
R17  0R  [R0603]  114.6,62.13 270 top
R18  100K  [R0603]  72.23,157.89 270 top
R19  1.2K  [DISCRETE_R0603]  97.38,61.52 90 top
R20  33R  [R0603]  124.99,109.19 180 top
R21  33R  [R0603]  125.01,107.65 180 top
R22  10K  [R0603]  119.27,62.1 270 top
R23  50R  [DISCRETE_R0603]  111.27,91.16 180 top
R24  200K  [R0603]  68.98,157.86 270 top
R25  10K  [R0603]  120.77,59.69 270 top
R26  10K  [R0603]  122.59,59.69 90 top
R27  5.1K  [DISCRETE_R0603]  124.99,121.67 0 top
R29  1.2K  [R0603]  64.11,162.33 0 top
R30  100R  [R0603]  59.94,167.36 180 top
R31  NC  [DISCRETE_R0603]  100.48,88.34 90 top
R32  3.6R  [DISCRETE_R0603]  103.68,98.32 0 top
R33  3.6R  [DISCRETE_R0603]  104.57,93.68 180 top
R34  100R  [R0603]  125.34,45.09 0 top
R35  0R  [R0603]  54.89,70.51 270 top
R36  NC  [DISCRETE_R0603]  52.68,66.7 180 top
R37  NC  [DISCRETE_R0603]  52.68,68.25 180 top
R38  5.1K  [DISCRETE_R0603]  124.99,117.2 0 top
R39  10K  [DISCRETE_R0603]  102.1,88.34 270 top
R40  33R  [R0603]  124.99,120.19 180 top
R41  0R  [R0603]  117.65,149.5 0 top
R42  NC  [DISCRETE_R0603]  52.68,65.22 180 top
R43  499K/NC  [R0603]  114.12,144.27 270 top
R44  10K  [DISCRETE_R0603]  52.65,69.75 180 top
R45  33R  [R0603]  124.99,118.69 180 top
R46  NC  [R0603]  117.42,34.52 180 top
R47  NC  [DISCRETE_R0603]  52.68,63.68 180 top
R48  3.3K  [R0603]  117.62,26.54 90 top
R49  47K  [R0603]  62.35,166.6 90 top
R50  680K  [R0603]  50.82,159.79 180 top
R51  5.1K  [DISCRETE_R0603]  125.09,136.5 0 top
R52  470K  [R0603]  50.82,161.37 0 top
R53  5.1K  [DISCRETE_R0603]  125.07,132 0 top
R54  33R  [R0603]  125.09,135 180 top
R55  51K  [DISCRETE_R0603]  106.57,185.34 0 top
R56  0R  [R0603]  39.52,84.07 90 top
R57  51K  [DISCRETE_R0603]  22.27,98.17 0 top
R58  10K  [DISCRETE_R0603]  125.12,89.23 180 top
R59  4.7K  [DISCRETE_R0603]  101.24,96.27 180 top
R60  10K  [DISCRETE_R0603]  101.24,94.69 0 top
R63  0R  [R0603]  52.7,62.05 180 top
R64  0R  [R0603]  61.87,177.5 0 top
R65  33R  [R0603]  125.09,133.5 180 top
R66  10K  [R0603]  11.15,89.41 180 top
R67  100K  [R0603]  11.12,87.86 180 top
R68  0R  [R0603]  11.17,90.98 0 top
R69  10K  [DISCRETE_R0603]  100.07,189.87 180 top
R70  10K  [DISCRETE_R0603]  101.6,191.41 180 top
R71  33R  [R0603]  100.07,192.96 0 top
R72  5.1K  [DISCRETE_R0603]  124.99,98.58 0 top
R73  5.1K  [DISCRETE_R0603]  125.12,93.8 0 top
R74  0R  [R0603]  27.35,109.37 0 top
R75  0R  [R0603]  27.81,107.9 0 top
R76  0R  [R0603]  28.27,106.43 0 top
R77  0R  [R0603]  28.72,104.95 0 top
R78  0R  [R0603]  29.16,103.48 0 top
R79  0R  [R0603]  22.25,102.67 0 top
R80  0R  [R0603]  22.27,107.09 0 top
R81  0R  [R0603]  22.14,109.4 90 top
R82  0R  [R0603]  17.5,110.13 90 top
R83  0R  [R0603]  22.27,101.14 0 top
R84  0R  [R0603]  22.27,96.65 0 top
R85  33R  [R0603]  125.07,96.98 180 top
R86  33R  [R0603]  125.04,95.43 180 top
R87  1.5K  [R0603]  100.07,166.67 270 top
R88  1.5K/NC  [R0603]  98.57,166.67 270 top
R89  0R  [R0603]  40.48,95.58 0 top
R90  0R  [R0603]  40.48,94.11 0 top
R91  0R  [R0603]  40.46,92.66 0 top
R92  0R  [R0603]  44.01,90.93 90 top
R93  0R  [R0603]  44.27,88.65 0 top
R94  0R  [R0603]  45.11,87.15 0 top
R95  4.02K  [R0603]  46.68,92.1 270 top
R96  0R  [R0603]  51.74,43.61 180 top
R97  0R  [R0603]  51.74,45.19 180 top
R98  0R  [R0603]  51.74,46.74 180 top
R99  0R  [R0603]  51.79,48.23 180 top
R100  0R  [R0603]  51.76,49.73 180 top
R101  33R  [R0603]  121.36,118.72 0 top
R102  0R  [R0603]  60.24,95.33 180 top
R103  100R  [R0603]  125.34,43.56 0 top
R104  100R  [R0603]  125.34,42.06 0 top
R105  100R  [R0603]  125.34,40.54 0 top
R106  100R  [R0603]  125.34,37.54 0 top
R107  100R  [R0603]  125.34,39.04 0 top
R108  10K  [DISCRETE_R0603]  32.71,84.84 180 top
R109  0R  [R0603]  51.79,51.31 180 top
R110  33R  [R0603]  121.38,120.19 0 top
R111  33R  [R0603]  122.12,133.96 0 top
R112  33R  [R0603]  122.09,135.51 0 top
R113  5.1K  [R0603]  101.34,179.17 270 top
R114  NC/5.1K  [R0603]  102.84,179.17 90 top
R115  NC/5.1K  [R0603]  94.1,166.67 90 top
R116  5.1K  [R0603]  91.87,167.44 180 top
R117  NC/5.1K  [R0603]  95.58,166.67 90 top
R118  5.1K  [R0603]  97.1,166.67 270 top
R119  NC/5.1K  [R0603]  95.68,177.83 0 top
R120  5.1K  [R0603]  95.68,176.33 180 top
R121  6.19K  [R0603]  103.07,167 90 top
R122  5.1K  [R0603]  92.5,172.26 0 top
R123  5.1K  [R0603]  92.53,175.26 180 top
R124  0R  [R0603]  60.4,113.33 90 top
R125  0R  [R0603]  58.95,113.33 90 top
R126  0R  [R0603]  57.48,113.36 90 top
R127  0R  [R0603]  56.03,113.36 90 top
R128  0R  [R0603]  54.56,113.36 90 top
R129  0R  [R0603]  101.98,195.94 0 top
R130  NC/5.1K  [R0603]  101.57,167.03 270 top
R131  NC/10K  [R0603]  105.15,176.86 180 top
R132  NC/10K  [R0603]  102.89,176.1 270 top
R133  0R  [R0603]  100.94,26.95 180 top
R134  0R  [R0603]  118.31,12.42 270 top
R135  0R  [R0603]  116.07,11.66 180 top
R136  0R  [R0603]  103.68,37.41 270 top
R137  0R  [R0603]  100.55,34.39 90 top
R138  10K/NC  [R0603]  108.5,35 270 top
R139  10K  [R0603]  107.01,35 90 top
R140  200R  [R0603]  124.61,12.19 90 top
R141  10R  [R0603]  121.99,152.96 0 top
R142  0R/NC  [R0603]  38.68,111.66 0 top
R143  10K  [R0603]  105.56,18.8 180 top
R144  0R  [R0603]  125.32,35.99 180 top
R145  100K  [R0603]  107.67,15.52 270 top
R146  22.1K  [R0603]  104.67,15.52 90 top
R147  0R  [R0603]  117.42,32.97 0 top
R148  2.2K  [R0603]  125.42,26.85 0 top
R149  NC  [DISCRETE_R0603]  119.76,35.31 90 top
R150  4.02K  [R0603]  52.62,94.31 270 top
R151  10K  [R0603]  121.23,38.68 270 top
R152  2.2K  [R0603]  124.61,15.32 270 top
R153  0R  [R0603]  38.22,107.34 180 top
R154  0R  [R0603]  38.17,105.61 180 top
R155  0R  [R0603]  104.69,12.5 90 top
R156  10K  [DISCRETE_R0603]  99.21,57.86 90 top
R157  10K  [DISCRETE_R0603]  101.98,49.07 0 top
R158  10K  [DISCRETE_R0603]  105.1,47.22 180 top
R159  10K  [DISCRETE_R0603]  108.17,48.74 180 top
R160  NC  [DISCRETE_R0603]  105.1,48.74 180 top
R161  NC  [DISCRETE_R0603]  108.15,47.22 180 top
R162  2.2K  [R0603]  127.73,13.79 90 top
R163  0R  [R0603]  126.97,11.51 0 top
R164  10K  [R0603]  119.86,15.44 90 top
R165  150K  [R0603]  122.91,15.42 90 top
R166  150K  [R0603]  125.14,17.7 180 top
R167  0R  [R0603]  125.17,19.23 0 top
R168  0R  [R0603]  125.17,23.7 0 top
R169  499K/NC  [R0603]  113.36,147.78 0 top
R170  0R  [R0603]  117.57,16.21 0 top
R171  0R  [R0603]  14.22,90.98 180 top
R172  10K  [DISCRETE_R0603]  119.3,100.23 90 top
R173  51K  [DISCRETE_R0603]  119.88,106.22 270 top
R174  10K  [DISCRETE_R0603]  115.36,123.47 0 top
R175  51K  [DISCRETE_R0603]  112.44,125.68 90 top
R176  10K  [DISCRETE_R0603]  122.98,125.58 90 top
R177  51K  [DISCRETE_R0603]  114.42,132.36 0 top
R178  1.5K  [R0603]  105.38,166.27 0 top
R179  1.5K  [R0603]  92.53,173.76 0 top
R180  10K  [DISCRETE_R0603]  118.64,45.8 90 top
R181  51K  [DISCRETE_R0603]  113.94,50.32 0 top
R182  3.3K  [R0603]  119.07,28.14 270 top
R183  2.2K  [R0603]  125.4,29.87 0 top
R184  0R  [R0603]  66.62,177.5 0 top
R185  0R  [R0603]  104.49,51.38 270 top
R186  51K  [DISCRETE_R0603]  22.27,99.67 0 top
R187  51K  [DISCRETE_R0603]  22.25,104.14 0 top
R188  51K  [DISCRETE_R0603]  22.27,105.61 0 top
R189  51K  [DISCRETE_R0603]  20.6,109.4 90 top
R190  51K  [DISCRETE_R0603]  19.05,110.13 90 top
R191  10K  [DISCRETE_R0603]  115.24,78.94 0 top
R192  51K  [DISCRETE_R0603]  118.49,79.53 0 top
R193  10K  [DISCRETE_R0603]  124.1,78.49 270 top
R194  51K  [DISCRETE_R0603]  123.03,76.07 180 top
R195  51K  [DISCRETE_R0603]  118.26,89.84 0 top
R196  NC  [R0603]  121.97,145.72 90 top
R197  2.2K  [R0603]  125.4,25.3 0 top
R198  2.2K  [R0603]  125.42,28.35 0 top
R199  4.7K  [R0603]  66.26,188.01 0 top
R200  47K  [R0603]  66.26,189.53 180 top
R207  22R  [R0603]  25.22,162.56 90 top
R208  22R  [R0603]  26.79,169.47 270 top
R209  22R  [R0603]  28.42,168.35 270 top
R210  5.1K  [R0603]  11.6,179.32 180 top
R211  5.1K  [R0603]  11.65,183.85 180 top
R212  22R  [R0603]  11.63,182.37 180 top
R213  22R  [R0603]  11.63,180.85 180 top
R214  4.7K  [R0603]  37.49,199.67 90 top
R215  47K  [R0603]  36.72,197.36 0 top
R216  1K  [R0603]  64.13,196.47 270 top
R217  0R  [R0603]  32.2,196.65 90 top
R218  1.2K  [R0603]  69.26,183.24 270 top
R219  100R  [R0603]  58.72,182.73 90 top
R220  47K  [R0603]  60.32,182.73 270 top
R221  30K  [R0603]  43.1,198.78 180 top
R222  10K  [R0603]  43.1,193.14 180 top
R223  30K  [R0603]  40.05,198.78 0 top
R224  10K  [R0603]  39.87,193.14 180 top
R225  30K  [R0603]  47.85,198.78 0 top
R226  10K  [R0603]  47.44,193.12 180 top
R227  30K  [R0603]  50.92,198.78 180 top
R228  10K  [R0603]  50.54,193.12 180 top
R230  1K  [R0603]  54.91,162.81 180 top
R231  1K  [R0603]  54.94,161.26 180 top
R232  0R  [R0603]  70.71,170.76 0 top
R235  0R  [R0603]  70.71,172.36 0 top
R236  0.4R  [1206]  98.8,71.63 90 top
R237  0.4R  [1206]  100.96,71.63 90 top
R238  1.2K  [R0603]  103.68,73.15 180 top
R239  50K  [R0603]  111.55,77.09 0 top
R240  3R  [R0603]  104.54,67.92 180 top
R241  0.1R  [DISCRETE_R2512]  115.39,69.32 90 top
R242  0.1R  [DISCRETE_R2512]  119.45,69.32 90 top
R243  5.76K  [R0603]  112.47,75.56 0 top
R244  150K  [R0603]  114.55,77.11 0 top
RST  TS24CA  [2*4*3.5MM]  140.3,60.92 270 top
RX  [TP-D45MIL]  27.71,182.45 0 top
SD  [9P-SMD-W/-RING]  127.4,189.6 0 top
SIM  MICROSIM  [MICROSIM]  16.12,173.53 180 top
SPK  1X2P  [1X2P-SMT1.25MM]  138.2,22.1 90 top
STA  NET  [CHIP-LED0805]  66.21,184 90 top
TX  [TP-D45MIL]  27.71,180.9 0 top
U1  ESP32-C6-MINI-1  [ESP32-C6-MINI-1]  11.17,99.34 90 top
U2  RY3730  [SOT23-6]  104.8,90.42 270 top
U3  CH340K  [ESOP-10-EP-150MIL]  117.14,56.06 90 top
U4  MP2143DJ-LF-Z  [TSOT23-8]  70.94,161.37 180 top
U5  SPX3819  [SOT23-5]  97.51,88.54 0 top
U7  AMS1117-3.3V  [SOT89]  100.96,17.48 90 top
U8  ESP32-P4  [QFN105-35P-500L500W]  49.12,103.17 0 top
U9  W25Q128JV  [SOIC-8-208MIL]  37.56,88.93 0 top
U10  SPX3819  [SOT23-5]  104.69,22.05 0 top
U11  TLV62569DBVR  [SOT23-5-95P-300L300W]  109.34,18.64 180 top
U12  ES8311  [QFN20-40P-300L300W55H]  105.96,30.23 270 top
U13  IP101GRI  [QFN32-40P-400W400L]  97.94,172.24 270 top
U14  SPX3819  [SOT23-5]  108.91,55.47 180 top
U15  SPX3819  [SOT23-5]  105.38,55.47 180 top
U16  SPX3819  [SOT23-5]  101.8,55.47 180 top
U17  TLV62569DBVR  [SOT23-5-95P-300L300W]  117.45,146.48 90 top
U18  A7670G  [A7670G]  43.58,177.5 270 top
U19  [QFN17-65P-400L400W80H]  109.67,71.37 315 top
U20  NS4150B  [MSOP8-65P-490L300W110H]  121.48,20.5 90 top
U$1  [MAKERFABS_0.3]  12.1,48.67 90 top
UN  [TP_4545]  18.23,96.72 90 top
UP  [TP_4545]  18.23,98.96 90 top
USB-CDC/JTAG  [USB-C-16P-5]  134.66,120.85 90 top
USB-DEVICE  [USB-C-16P-5]  134.66,96.53 90 top
USB-LTE  [USB-C-16P-5]  8.3,182.09 270 top
USB-NATIVE  [USB-C-16P-5]  134.66,108.57 90 top
USB-OTG  [USB-C-16P-5]  134.66,132.99 90 top
USB-TTL  [USB-C-16P-5]  134.66,51.46 90 top
VPWR  [TP_4545]  105.81,85.29 90 top
X1  40MHz(10ppm)  [NX3225]  45.11,116.54 270 top
X2  25MHz(10ppm)  [NX3225]  99.06,178.97 270 top
X3  24MHz  [OSC4-SMD-2.5X2.0X0.8MM]  122.17,35.41 0 top

## Tracks (layer width: path | path; a pad name or v marks a point on that pad's centre or on a via)
1.8V  (via drill 0.3)
  Top 0.025: 56.82,168.5 v56.77,168.5
  Top 0.178: Q35.1 46.6,194.88 v46.6,194.08 | Q34.1 38.98,194.9 v38.98,194.08
  Top 0.406: U18.97 56.82,168.5 57.83,167.49 57.83,166.17 C208.2 C209.2 D6.+
  Top 0.61: U18.15 37.58,191.38 1V8.T 38.1,192.13 39,193.03 | 39,193.03 R224.2 | Q34.1 39,193.03 | R222.2 v42.34,194.08 Q33.1 | Q35.1 46.59,193.2 R226.2 | R228.2 v49.78,194.08 49.78,194.75 Q36.1
  Bottom 0.61: v38.98,194.08 v42.34,194.08 v46.6,194.08 v49.78,194.08 52.57,194.08 56.77,189.89 v56.77,168.5
3.3V  (via drill 0.3)
  Top 0.178: v97.56,11.74 v97.56,11.73
  Top 0.406: U1.3 8.77,91 C9.1 | 8.78,87.86 C22.1 | R67.2 | 23.03,104.17 R187.2 | 103.26,11.73 C30.2 | 101.81,11.72 C16.2 | C24.2 | C17.2 | 97.58,11.71 v97.56,11.73
  Top 0.61: C9.1 8.78,89.99 | 8.78,89.99 C5.1 | C5.1 8.78,87.86 | C22.1 R67.2 | C5.1 R66.2 10.51,89.41 10.51,87.73 9.72,87.73 | R188.2 v23.03,104.88 23.03,104.17 | P1.1 1.44,111.73 2.87,113.16 v23.03,113.16 | v33.47,57.25 v23.03,57.25 | R57.2 v23.03,98.91 R186.2 | R155.1 103.26,11.73 | C30.2 101.81,11.72 | C16.2 C24.2 | C24.2 C17.2 | C17.2 97.58,11.71 | R44.2 50.77,69.75 50.44,69.42 50.44,67.11 50.85,66.7 R36.2 R42.2 R47.2 51.94,63.67 R63.2 51.95,62.04 C29.2 51.93,60.41 C23.2 R1.2 51.91,57.25 v51.02,57.25 | v23.03,85.14 11.68,85.14 10.36,86.46 10.36,87.1 | 10.36,87.1 R67.2 10.36,88.47 10,88.82 9.06,88.82 9.06,88.57 9.29,88.34 10.18,88.34 10.18,88.59 8.78,89.99 | R190.2 19.4,111.25 19.5,111.25 | 20.42,111.25 21.31,111.25 | 21.31,111.25 v23.03,111.25 | R189.2 20.59,111.07 20.42,111.25 | 20.67,110.39 20.67,110.62 21.31,111.25 | 20.42,111.25 19.5,111.25 | 19.5,111.25 19.02,110.77 20.32,110.77 20.57,110.52 | 8.84,87.73 9.72,87.73 | 9.72,87.73 10.36,87.1
  Bottom 0.178: 22.98,110.9 22.98,111.2 v23.03,111.25
  Bottom 0.406: 22.98,110.9 23.03,110.85
  Bottom 0.61: v51.02,57.25 v33.47,57.25 | v23.03,113.16 v23.03,111.25 23.03,110.85 v23.03,104.88 v23.03,98.91 v23.03,85.14 v23.03,57.25 23.03,36.09 31.85,27.28 82.01,27.28 v97.56,11.73
25M_XI
  Top 0.178: 99.59,176.54 C117.2
  Top 0.229: U13.2 98.94,175.32 99.59,175.97 99.59,176.54
  Top 0.254: C117.2 99.58,177.59 X2.3
25M_XO
  Top 0.178: 97.25,179.16 C116.1
  Top 0.229: U13.3 98.54,175.5 97.25,176.78 97.25,179.16
  Top 0.254: C116.1 97.55,179.36 X2.1
+3V3  (via drill 0.3)
  Top 0.178: J8.1 57.6,37.14 57.53,37.21
  Top 0.254: C184.1 55.27,64.03 55.44,64.21 | J8.3 J8.1 | 57.48,37.52 57.45,36.07 | J8.2 57.41,40.4 57.45,40.36 | 55.44,64.21 58.78,67.55 P4.1 58.95,67.5 58.95,67.46 55.39,63.91 | 55.47,63.09 55.47,64.19 55.44,64.21 | 57.53,37.21 57.53,37.34 57.45,37.41
  Top 0.305: J8.6 56.1,41.17 56.49,41.55 | 56.49,41.55 57.45,41.55 | 56.49,41.55 57.53,42.6 57.53,42.24 56.92,41.63 | 57.53,37.77 57.53,37.21 57.53,35.89 57.02,35.89 57.02,36.75 57.5,37.24 | 55.47,63.09 55.47,62.31 | 109.78,58.63 C159.2 | P2.5 92.65,58.62 v92.71,58.57 93.06,58.57 93.11,58.62 92.66,59.08 92.63,59.08 92.12,58.57 92.05,58.57
  Top 0.406: R225.2 49.37,198.78 v49.4,198.81
  Top 0.61: v119.76,27.38 R182.2 117.7,27.38 R48.2 | C42.1 96.57,89.86 U5.5 87.4,89.84 83.59,86.03 83.59,59.11 | U14.1 109.86,58.53 C159.2 | C20.1 | C20.1 C25.1 | C25.1 C60.2 | C60.2 C27.1 | C27.1 C66.2 R156.2 | U16.1 102.75,58.56 C27.1 | U15.3 104.43,58.54 C60.2 | U15.1 C25.1 | U14.3 107.96,58.38 C20.1 | R156.2 99.21,60.16 PWR.A | U3.7 v118.14,60.35 118.14,60.98 C19.2 R22.2 | X3.4 121.13,36.07 R149.2 v119.02,36.07 | X3.1 X3.4 | X3.4 121.25,37.91 R151.2 | C159.2 C20.1 | R63.1 C184.1 C185.2 v55.27,58.57 55.27,55.35 57.45,53.16 57.45,41.55 57.45,40.36 57.45,37.41 57.45,36.07 | 83.59,59.11 v83.59,58.57 95.96,58.57 C46.2 | 83.59,59.11 84.12,58.57 | v114.8,59.72 115.14,59.38 U3.10 114.98,58.6 C3.2 C18.2 111.4,58.57 111.35,58.62 C159.2 | 113.2,58.62 113.71,58.62 v114.8,59.72 | v114.8,59.72 114.8,58.98 114.5,58.67 | R156.2 97.66,58.62 C47.2 C46.2 | v92.71,58.57 95.95,58.57 C46.2 | R223.2 v41.58,198.81 R221.2 | R225.2 R227.2 | R217.2 v32.2,198.81 | v132.31,220.01 J2.3 | J1.3 v132.31,206.3
  Bottom 0.178: 43.56,198.81 43.51,198.81 v41.58,198.81
  Bottom 0.61: v83.59,58.57 v55.27,58.57 | v119.76,27.38 119.76,35.33 v119.02,36.07 115.21,36.07 v92.71,58.57 | v114.8,59.72 117.51,59.72 v118.14,60.35 132.31,74.51 132.31,198.3 | 132.31,198.3 132.31,198.86 | 132.31,198.86 132.31,199.31 | v32.2,198.81 43.51,198.81 | 43.56,198.81 v49.4,198.81 131.8,198.81 | 131.8,198.81 132.25,198.81 132.31,198.86 | v132.31,220.01 v132.31,206.3 132.31,199.87 132.31,199.31 | 132.31,198.3 131.8,198.81 | 131.8,198.81 132.31,199.31
A3V3
  Top 0.813: R133.2 100.17,26.44 100.66,25.96 C139.2 C137.1 100.67,23.35 FB3.2 U10.5
ADCVREF  (via drill 0.3)
  Top 0.229: U12.15 106.77,27.95 v107.36,27.36 C126.2
  Top 0.254: v124.61,9.75 R140.1
  Bottom 0.229: v124.61,9.75 117.12,9.75 116.15,10.72 116.15,14.88 107.36,23.67 v107.36,27.36
AGND  (via drill 0.3, 0.6)
  Top 0.178: C131.2 104.06,31.73 U12.5 105.17,31.18 105.33,31.01 105.33,30.86 U12.21 105.56,29.82 105.41,29.82 105.01,29.43 U12.10 | 105.1,31.9 104.09,31.9 102.43,33.55 102.23,33.35 103.98,31.6 105.18,31.6
  Top 0.254: C149.1 C148.2 124.41,21.44 v124.38,21.46 | v121.15,23.57 U20.7 | v106.27,29.77 106.27,29.92 U12.21 | 104.06,31.73 102.43,33.35 102.23,33.35
  Top 0.406: U20.7 121.15,21.57 120.8,21.21 C142.2 | 121.36,13.13 121.41,13.13 121.41,13.16 C144.2 | C118.2 v105.51,36.8 | v102.16,36.3 102.16,35.28 102.21,35.23 102.16,35.18 C132.2
  Top 0.61: C121.2 C120.2 C119.2 100.17,33.25 R137.1 C131.2 C132.2 | C127.1 C126.1 v108.68,25.27 C128.2 112.9,25.27 115.54,22.63 C141.2 | MIC.3 MIC.2 140.16,16.1 C164.2 C161.1 C163.2 v135.53,15.34 C162.2 | C141.2 C143.2 C142.2 | R139.2 C118.2 | C141.2 v114.58,21.21 | R163.1 v126.21,12.24 C135.2 | C144.2 121.18,12.98 v120.65,12.98 120.06,12.98 C146.2 R164.1 | R164.1 C140.2 | R164.1 119.88,14.66 v120.65,14.66 | 121.36,13.13 C144.2 | C144.2 121.36,14.63 120.93,14.2 120.21,14.2 120.21,13.36 121.1,13.36 121.13,13.39 121.13,13.79 120.44,13.79
  Bottom 0.254: v124.38,21.46 123.26,21.46 v121.15,23.57
  Bottom 0.406: v105.51,36.8 102.66,36.8 v102.16,36.3
  Bottom 0.61: v108.68,25.27 108.68,27.36 v106.27,29.77 | v114.58,21.21 114.58,19.68 119.61,14.66 v120.65,14.66 | v120.65,12.98 125.42,12.98 | 125.42,12.98 126.21,12.98 | 126.21,12.98 126.94,12.98 | 126.94,12.98 126.97,12.98 129.33,15.34 v135.53,15.34 | 126.94,12.98 v126.21,12.24 | 125.42,12.98 126.16,12.24 v126.21,12.24 | v126.21,12.24 126.21,12.98
ANT
  Top 0.61: U18.60 C53.2 R64.1
AVDD
  Top 0.178: 101.93,28.73 C121.1
  Top 0.229: U12.11 101.93,28.73
  Top 0.305: R133.1 C121.1
BAT
  Top 0.406: FB2.1 121.22,152.97 R141.1
BOOT  (via drill 0.3)
  Top 0.406: U18.6 46.58,190.85 45.36,192.07 v45.36,197.76 | v54,197.76 54.99,197.76 BOOT1.2
  Bottom 0.406: v45.36,197.76 v54,197.76
C6_EN  (via drill 0.3)
  Top 0.178: U1.8 arc-45 U1.8
  Top 0.203: v13.43,91.67 13.46,91.67
  Top 0.406: U1.8 12.77,92.35 13.46,91.67 R171.2 13.46,89.43 C1.1 | R66.1 C1.1 | C1.1 14.9,89.41 C6_RST.4 18.18,89.37 | 18.18,89.37 C6_RST.3 | C6_EN.T 18.26,90.12 18.26,89.94 | 18.26,89.71 18.26,89.45 18.18,89.37 | 17.93,89.38 18.26,89.71 | 18.26,89.71 18.26,89.94 | 18.26,89.94 18.74,89.46
  Bottom 0.406: P1.6 14.14,92.38 v13.43,91.67
C6_IO2
  Top 0.406: U1.5 10.37,91.02 R68.1
C6_U0RXD
  Top 0.406: U1.30 11.17,106.35 9.83,107.7 9.09,107.7 C6_U0RXD.T P1.4
C6_U0TXD
  Top 0.406: U1.31 10.37,105.96 9.95,106.38 7.87,106.38 C6_U0TXD.T P1.3
CCLK  (via drill 0.3)
  Top 0.254: J4.14 126.39,35.5 v126.08,35.19
  Top 0.305: C87.2 v126.08,35.19 R144.1 | R142.1 38.63,110.77 40.66,110.77 v41.47,109.96
  Bottom 0.254: 126.07,35.2 v126.08,35.19
  Bottom 0.305: v41.47,109.96 41.47,72.95 44.6,69.83 82.52,69.83 115.52,36.83 119.38,36.83 121.02,35.19 v126.08,35.19
CODEC_CE  (via drill 0.3)
  Top 0.229: v107.74,31.73 107.74,31.3 U12.20 | R138.2 v107.74,34.24 R139.1
  Bottom 0.229: v107.74,31.73 v107.74,34.24
COL
  Top 0.229: U13.4 98.14,175.21 97.02,176.33 R120.1
  Top 0.254: R120.1 R119.2
CRS
  Top 0.229: U13.20 97.74,168.84 97.23,168.33 94.99,168.33 R115.2
  Top 0.254: R115.2 R116.1
CSI_1V8  (via drill 0.3)
  Top 0.254: J4.16 130.93,34.5 v130.81,34.62
  Top 0.406: 126.16,26.82 R148.2 | 126.18,29.84 R183.2
  Top 0.61: U15.5 C31.1 | C31.1 v106.32,51.28 C32.2 | C31.1 R185.1 | R197.2 126.16,26.82 | R148.2 R198.2 126.18,29.06 | 126.18,29.06 126.18,29.84 | v132.15,29.39 126.51,29.39 126.18,29.06
  Bottom 0.61: v132.15,29.39 132.15,33.27 v130.81,34.62 129.38,36.04 121.31,36.04 119.66,37.69 115.95,37.69 110.05,43.59 110.05,44.37 106.32,48.11 v106.32,51.28
CSI_2V8  (via drill 0.3)
  Top 0.254: J4.23 J4.24 137.1,30.65 137.21,30.76 | 136.44,30.76 137.21,30.76 | 137.21,30.76 137.59,30.76 137.61,30.73
  Top 0.61: 136.44,30.76 v133.12,30.76 | U14.5 C21.1 C108.2 v109.85,49.99
  Bottom 0.61: v133.12,30.76 133.12,33.73 129.92,36.93 121.79,36.93 120.06,38.66 116.4,38.66 111.12,43.94 111.12,44.73 109.85,46 v109.85,49.99
CSI_A_CLKN
  Top 0.254: J4.6 128.67,39.5 R104.2
CSI_A_CLKP
  Top 0.254: J4.7 127.65,39 R105.2
CSI_A_DATA0N
  Top 0.254: J4.9 127.15,38 R107.2
CSI_A_DATA0P
  Top 0.254: J4.10 126.15,37.5 R106.2
CSI_A_DATA1N
  Top 0.254: J4.3 130.2,41 R34.2
CSI_A_DATA1P
  Top 0.254: J4.4 129.17,40.5 R103.2
CSI_REXT
  Top 0.178: U8.48 52.09,95.6 R150.1
CSI_RST
  Top 0.305: J4.17 127.77,34 126.74,32.97 C88.2 124.08,32.97 CSI_RST.3 CSI_RST.4 | CSI_RST.4 118.3,33.08 | 118.3,33.08 R147.2 | 118.3,33.08 118.3,34.4 R46.1 | R149.1 119.76,33.19 CSI_RST.4
CSI_SCL  (via drill 0.3)
  Top 0.254: J4.21 128.97,32 v128.85,31.88
  Top 0.406: Q20.2 v123.92,29.88 124.62,29.88 R183.1
  Bottom 0.254: v128.85,31.88 125.92,31.88 v123.92,29.88
CSI_SDA  (via drill 0.3)
  Top 0.254: J4.20 128.97,32.5 v128.85,32.61
  Top 0.406: Q19.2 v123.59,26.73 124.54,26.73 R148.1
  Bottom 0.254: v123.59,26.73 123.26,27.06 123.26,30.15 125.73,32.61 v128.85,32.61
D+
  Top 0.254: U3.1 115.14,52.16 116.1,51.21 USB-TTL.A6 137.21,51.21 137.46,51.46 137.46,52.05 136.98,52.53 136.27,52.53 135.95,52.21 USB-TTL.B6
D-  (via drill 0.3)
  Top 0.254: U3.2 116.14,52.26 116.69,51.71 USB-TTL.A7 136.56,51.71 v136.7,51.84 | USB-TTL.B7 136.51,50.71 v136.7,50.52
  Bottom 0.254: v136.7,50.52 v136.7,51.84
DACVREF
  Top 0.178: 106.37,26.85 C127.2
  Top 0.229: U12.14 106.37,26.85
DSI_A_CLKN
  Top 0.254: R98.1 54.1,45.14 54.1,41.73 53.7,41.33 J8.14
DSI_A_CLKP  (via drill 0.3)
  Top 0.254: R99.1 54.78,46 v54.78,42.6 | J8.15 53.4,36.92 v53.74,37.26
  Bottom 0.254: v53.74,37.26 53.74,39.88 54.78,40.92 v54.78,42.6
DSI_A_DATA0N  (via drill 0.3)
  Top 0.178: v54.6,37.08 v54.61,37.08
  Top 0.254: R109.1 56,47.85 v56,42.62 | J8.11 v54.6,37.08
  Bottom 0.254: v54.61,37.08 54.61,39.67 56,41.07 v56,42.62
DSI_A_DATA0P
  Top 0.254: J8.12 54.3,40.94 55.39,42.04 55.39,46.86 R100.1
DSI_A_DATA1N  (via drill 0.3)
  Top 0.178: v52.8,37.26
  Top 0.254: v53.41,42.11 53.41,44.27 R97.1 | J8.17 v52.8,37.26
  Bottom 0.254: v52.8,37.26 52.8,40.06 53.41,40.66 v53.41,42.11
DSI_A_DATA1P
  Top 0.254: J8.18 R96.1
DSI_REXT
  Top 0.178: U8.34 47.2,93.38 R95.1
DTR  (via drill 0.3)
  Top 0.254: R26.2 122.69,60.55 | v118.14,52.54 v118.13,52.53
  Top 0.406: 122.69,60.55 v122.69,61.19 Q3.2 | U3.4 v118.14,52.54
  Bottom 0.254: 122.73,61.15 v122.69,61.19
  Bottom 0.406: 122.73,61.15 122.73,58.47 122.73,57.12 v118.13,52.53
EN_DCDC  (via drill 0.3)